# EAGLE design datalogger-v11 (EAGLE 7.7.0)
DATABASE: /Users/kina/Documents/eagle/PARTSDB.txt

## Sheet 1 of 2
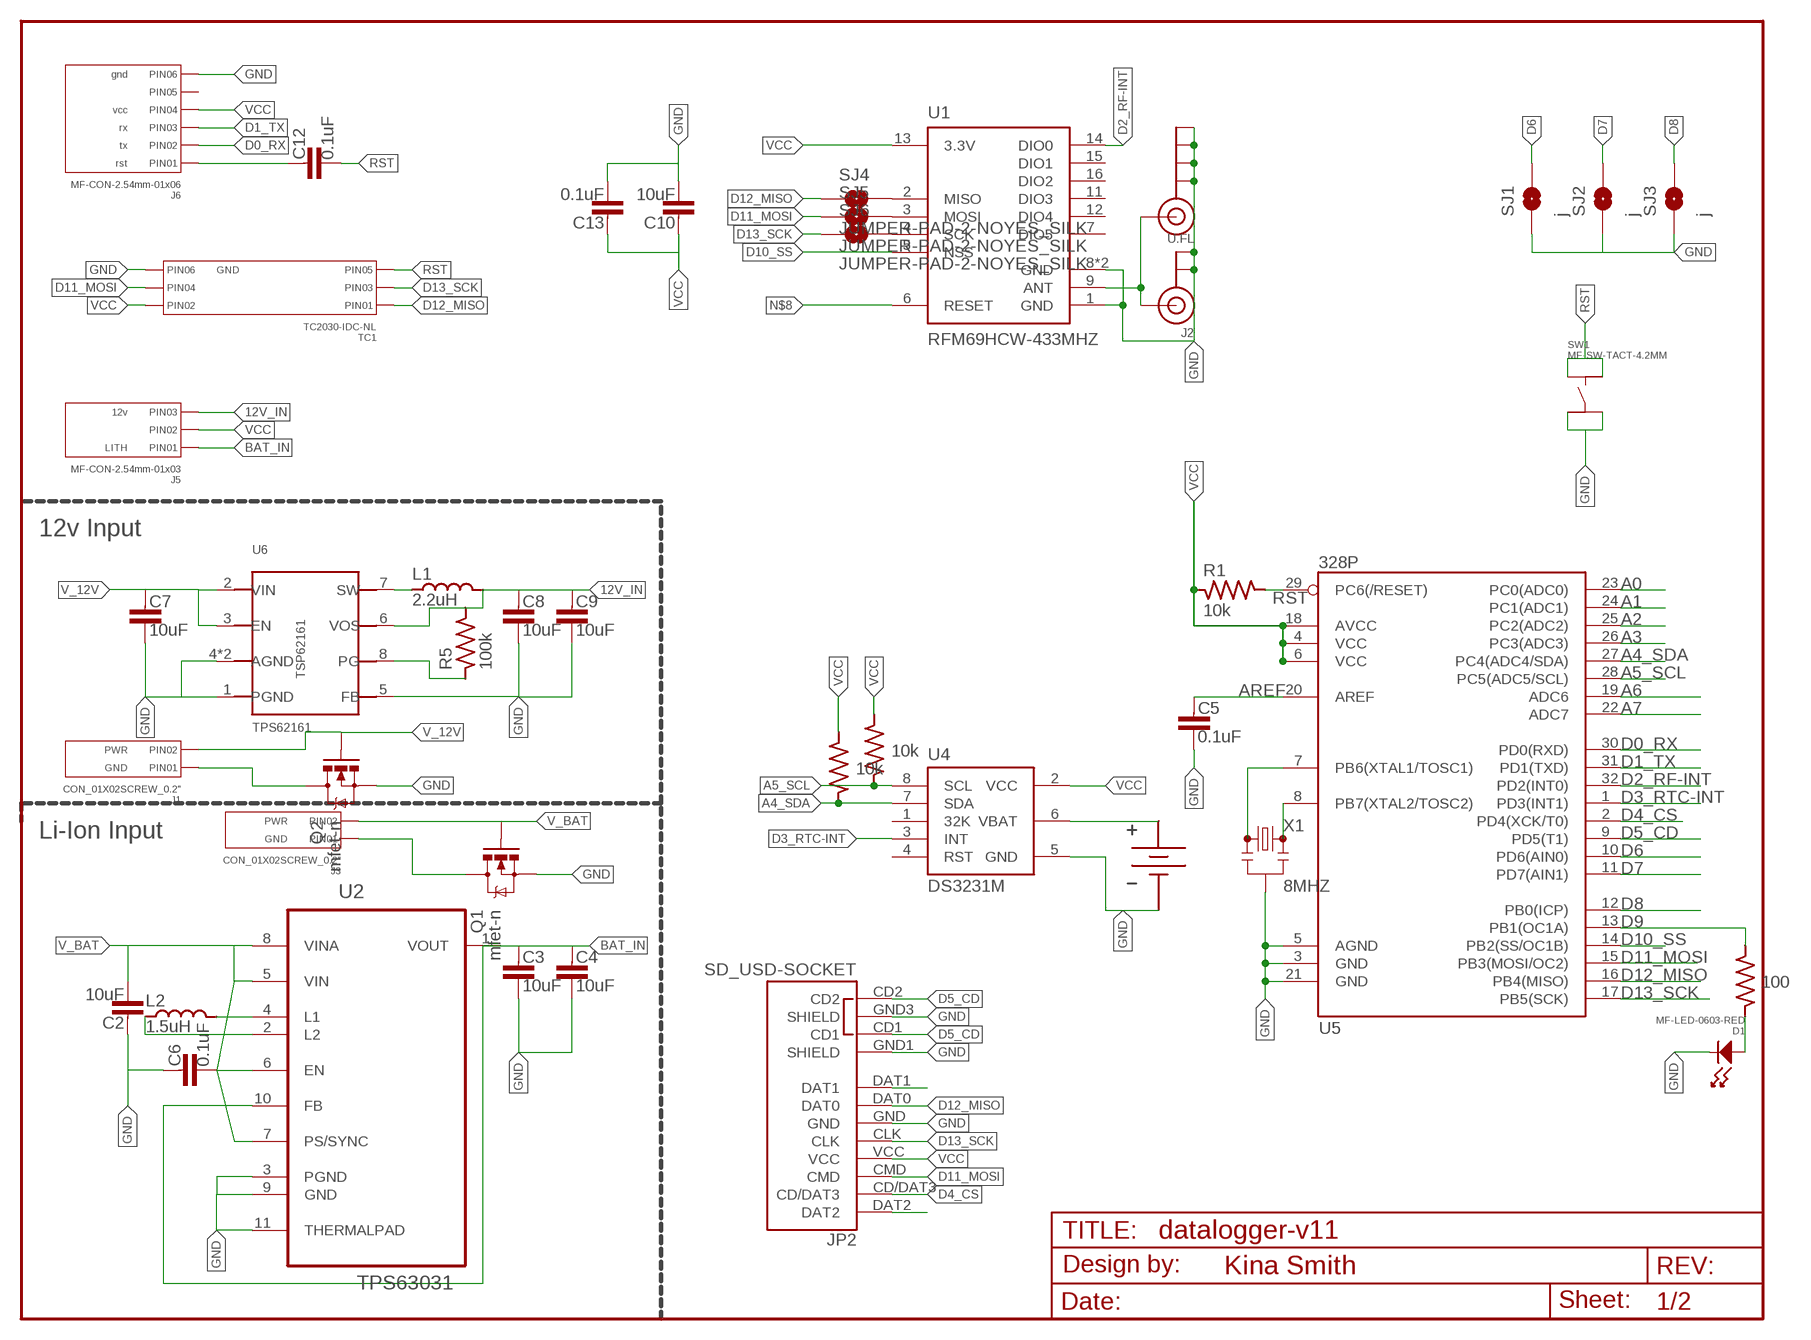
[diagram p0: schematic, sheet 1]

### Parts
BAT1  BATTERY_HOLDER12MM  [BAT_12MM]
C2  10uF  CAPACITOR_NP0805-N  [C0805-N]
C3  10uF  CAPACITOR_NP0805-N  [C0805-N]
C4  10uF  CAPACITOR_NP0805-N  [C0805-N]
C5  0.1uF  CAPACITOR_NP0603-N  [C0603-N]
C6  0.1uF  CAPACITOR_NP0603-N  [C0603-N]
C7  10uF  CAPACITOR_NP0805-N  [C0805-N]
C8  10uF  CAPACITOR_NP0805-N  [C0805-N]
C9  10uF  CAPACITOR_NP0805-N  [C0805-N]
C10  10uF  CAPACITOR_NP0805-N  [C0805-N]
C12  0.1uF  CAPACITOR_NP0603-N  [C0603-N]
C13  0.1uF  CAPACITOR_NP0603-N  [C0603-N]
D1  MF-LED-0603-RED  LED_SINGLE-0603-RED  [LED0603]
FRAME1  FRAME-LETTERNO_PACKAGE  [DUMMY]
J1  CON_01X02SCREW_0.2"  [SCREW_TERM_2POS]
J2  U.FL  ANTENNA_U.FL  [ADAFRUIT_U.FL]
J3  CON_01X02SCREW_0.2"  [SCREW_TERM_2POS]
J4  ANTENNA_SMA_EDGE  [SMA-EDGE]
J5  MF-CON-2.54mm-01x03  CON_01X03_PTH_2.54MM  [PTH_2.54MM_01X03]
J6  MF-CON-2.54mm-01x06  CON_01X06_PTH_2.54MM  [PTH_2.54MM_01X06]
JP2  SD_USD-SOCKET  [MICRO-SD-SOCKET-SDIO]
L1  2.2uH  INDUCTOR2520  [L2520]
L2  1.5uH  INDUCTOR3030  [L3030]
Q1  mfet-n  MOSFET-NCHANNELSOT23-3  [SOT23-3]
Q2  mfet-n  MOSFET-NCHANNELSOT23-3  [SOT23-3]
R1  10k  RESISTOR0603-N  [R0603-N]
R2  100  RESISTOR0603-N  [R0603-N]
R3  10k  RESISTOR0603-N  [R0603-N]
R4  10k  RESISTOR0603-N  [R0603-N]
R5  100k  RESISTOR0603-N  [R0603-N]
SJ1  j  JUMPER-PAD-2-NOYES_SILK  [PAD-JUMPER-2-NO_YES_SILK]
SJ2  j  JUMPER-PAD-2-NOYES_SILK  [PAD-JUMPER-2-NO_YES_SILK]
SJ3  j  JUMPER-PAD-2-NOYES_SILK  [PAD-JUMPER-2-NO_YES_SILK]
SJ4  JUMPER-PAD-2-NOYES_SILK  [PAD-JUMPER-2-NO_YES_SILK]
SJ5  JUMPER-PAD-2-NOYES_SILK  [PAD-JUMPER-2-NO_YES_SILK]
SJ6  JUMPER-PAD-2-NOYES_SILK  [PAD-JUMPER-2-NO_YES_SILK]
SW1  MF-SW-TACT-4.2MM  TACT_4.2MM  [TACT4.2MM]
TC1  TC2030-IDC-NL  CON_02X03_AVRISP_TC2030-IDC-NL  [TC2030-IDC-NL]
U1  RFM69HCW-433MHZ  [RFM69HCW-XXXS2]
U2  TPS63031  [SON50P260X260X80-11N]
U4  DS3231M  [SO08]
U5  328P  ATMEGA328P-AU  [TQFP32-08]
U6  TPS62161  [WSON-8]
X1  8MHZ  RESONATOR8MHZ  [RESONATOR-SMD]

### Nets
3V3L1: L2.P$2 U2.4(L1)
3V3L2: L2.P$1 U2.2(L2)
12V_IN: C8.1 C9.1 J5.P$3(PIN3) L1.P$2 R5.2 U6.6(VOS)
A0: U5.23(PC0(ADC0))
A1: U5.24(PC1(ADC1))
A2: U5.25(PC2(ADC2))
A3: U5.26(PC3(ADC3))
A4_SDA: R4.1 U4.7(SDA) U5.27(PC4(ADC4/SDA))
A5_SCL: R3.1 U4.8(SCL) U5.28(PC5(ADC5/SCL))
A6: U5.19(ADC6)
A7: U5.22(ADC7)
ANT: J2.3(SIGNAL) J4.SIG(SIGNAL) U1.9(ANT)
AREF: C5.1 U5.20(AREF)
BAT_IN: C3.1 C4.1 J5.P$1(PIN1) U2.1(VOUT) U2.10(FB)
D0_RX: J6.P$2(PIN2) U5.30(PD0(RXD))
D1_TX: J6.P$3(PIN3) U5.31(PD1(TXD))
D2_RF-INT: U1.14(DIO0) U5.32(PD2(INT0))
D3_RTC-INT: U4.3(INT) U5.1(PD3(INT1))
D4_CS: JP2.CD/DAT3 U5.2(PD4(XCK/T0))
D5_CD: JP2.CD1 JP2.CD2 U5.9(PD5(T1))
D6: SJ1.2 U5.10(PD6(AIN0))
D7: SJ2.2 U5.11(PD7(AIN1))
D8: SJ3.2 U5.12(PB0(ICP))
D9: R2.2 U5.13(PB1(OC1A))
D10_SS: U1.5(NSS) U5.14(PB2(SS/OC1B))
D11_MOSI: JP2.CMD SJ5.1 TC1.P$4(PIN4) U5.15(PB3(MOSI/OC2))
D12_MISO: JP2.DAT0 SJ4.1 TC1.P$1(PIN1) U5.16(PB4(MISO))
D13_SCK: JP2.CLK SJ6.1 TC1.P$3(PIN3) U5.17(PB5(SCK))
GND [power]: BAT1.GND C2.1 C3.2 C4.2 C5.2 C6.1 C7.2 C8.2 C9.2 C10.2 C13.2 D1.CATHODE J2.1(GND) J2.2(GND) J4.GND@0(GND) J4.GND@1(GND) J4.GND@2(GND) J4.GND@3(GND) J6.P$6(PIN6) JP2.GND JP2.GND1(SHIELD) JP2.GND3(SHIELD) Q1.2(S) Q2.2(S) SJ1.1 SJ2.1 SJ3.1 SW1.P$3 SW1.P$4 TC1.P$6(PIN6) U1.1(GND) U1.8(GND) U1.10(GND) U2.3(PGND) U2.9(GND) U2.11(THERMALPAD) U4.5(GND) U5.3(GND) U5.5(AGND) U5.21(GND) U6.1(PGND) U6.4(AGND) U6.5(FB) U6.P$9(AGND) X1.2
N$1: U5.7(PB6(XTAL1/TOSC1)) X1.1
N$2: D1.ANODE R2.1
N$3: JP2.DAT2
N$4: C12.1 J6.P$1(PIN1)
N$5: J3.GND(PIN1) Q1.3(D)
N$7: SJ4.2 U1.2(MISO)
N$8: U1.6(RESET)
N$9: SJ5.2 U1.3(MOSI)
N$10: BAT1.PWR@1(VBAT) BAT1.PWR@2(VBAT) U4.6(VBAT)
N$11: J1.GND(PIN1) Q2.3(D)
N$13: JP2.DAT1
N$15: SJ6.2 U1.4(SCK)
N$18: R5.1 U6.8(PG)
N$21: U5.8(PB7(XTAL2/TOSC2)) X1.3
RST: C12.2 R1.2 SW1.P$1 SW1.P$2 TC1.P$5(PIN5) U5.29(PC6(/RESET))
SW: L1.P$1 U6.7(SW)
V_12V: C7.1 J1.PWR(PIN2) Q2.1(G) U6.2(VIN) U6.3(EN)
V_BAT: C2.2 C6.2 J3.PWR(PIN2) Q1.1(G) U2.5(VIN) U2.6(EN) U2.7(PS/SYNC) U2.8(VINA)
VCC: C10.1 C13.1 J5.P$2(PIN2) J6.P$4(PIN4) JP2.VCC R1.1 R3.2 R4.2 TC1.P$2(PIN2) U1.13(3.3V) U4.2(VCC) U5.4(VCC) U5.6(VCC) U5.18(AVCC)
Unconnected: J6.P$5(PIN5) U1.7(DIO5) U1.11(DIO3) U1.12(DIO4) U1.15(DIO1) U1.16(DIO2) U4.1(32K) U4.4(RST)

### Notes on the sheet
- 12v Input
- Li-Ion Input

## Sheet 2 of 2
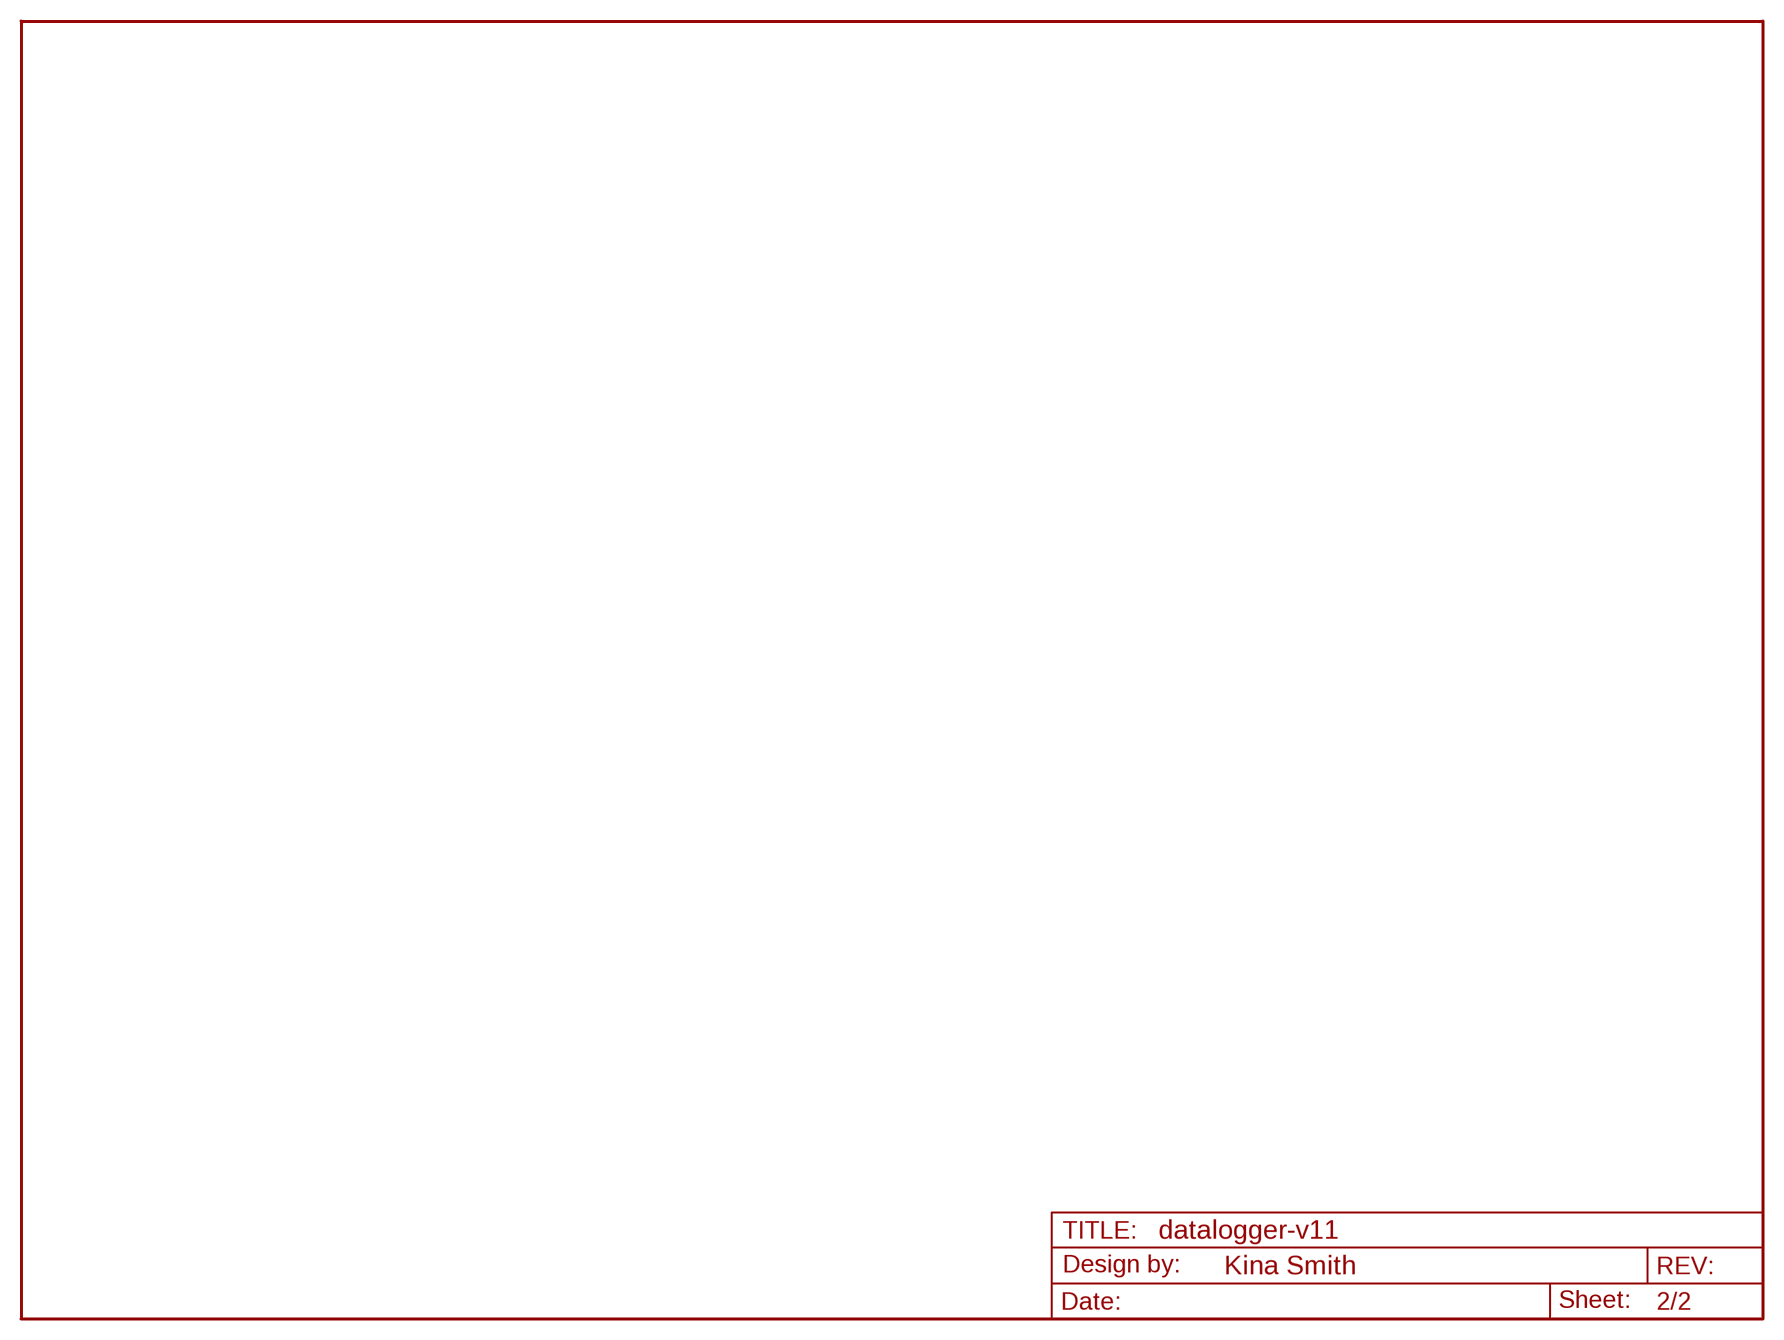
[diagram p1: schematic, sheet 2]

### Parts
FRAME3  FRAME-LETTERNO_PACKAGE  [DUMMY]

## Library data of the parts
BAT1 = My_Connectors:BATTERY_HOLDER; PARTNO: BK-885-TR
C2-C4 C7-C10 = My_Passives:CAPACITOR_NP; PARTNO: GRM21BR61C106KE15L
C5 C6 C12 C13 = My_Passives:CAPACITOR_NP; PARTNO: CC0603KRX7R7BB104
D1 = My_LEDs:LED_SINGLE: Library: MF_LEDs Description: Device for Single LED Packages. Manufacture part number (MFG#) can be added via Attributes.; HOUSEPART: YES; MPN: MF-LED-0603-RED; PARTNO: LTST-C191KRKT; POPULATE: 1; URL: https://factory.macrofab.com/part/MF-LED-0603-RED
FRAME1 FRAME3 = _my-parts:FRAME-LETTER: Schematic Frame Standard 8.5x11 US Letter frame; DESIGNER: Nobody; VERSION: v01
J1 J3 = My_Connectors:CON_01X02: Library: MF_Connectors Description: Header Connector with 02 Positions and 01 Rows. Use the LABEL Attribute to label the pin on the schematic and PCB. You can remove the attributes on the PCB by using the SMASH function on the part and then deleting the text.; LABEL01: GND; LABEL02: PWR; PARTNO: 1729128
J2 = My_Connectors:ANTENNA_U.FL: U.FL Antenna Connector; PARTNO: U.FL-R-SMT-1(10)
J4 = My_Connectors:ANTENNA_SMA_EDGE: SMA Antenna Connector End launch SMA connector. The paste layer has been removed so that the connector can be hand soldered onto the board after reflow.; PARTNO: EMPCB.SMAFSTJ.B.HT
J5 = My_Connectors:CON_01X03: Library: MF_Connectors Description: Header Connector with 03 Positions and 01 Rows. Use the LABEL Attribute to label the pin on the schematic and PCB. You can remove the attributes on the PCB by using the SMASH function on the part and then deleting the text.; HOUSEPART: YES; LABEL01: LITH; LABEL03: 12v; MPN: MF-CON-2.54mm-01x03; PARTNO: NA; POPULATE: 1; URL: https://factory.macrofab.com/part/MF-CON-2.54mm-01x03
J6 = My_Connectors:CON_01X06: Library: MF_Connectors Description: Header Connector with 6 Positions and 01 Rows. Use the LABEL Attribute to label the pin on the schematic and PCB. You can remove the attributes on the PCB by using the SMASH function on the part and then deleting the text.; HOUSEPART: YES; LABEL01: rst; LABEL02: tx; LABEL03: rx; LABEL04: vcc; LABEL06: gnd; MPN: MF-CON-2.54mm-01x06; PARTNO: NA; POPULATE: 1; URL: https://factory.macrofab.com/part/MF-CON-2.54mm-01x06
JP2 = My_Connectors:SD_USD-SOCKET: microSD Socket Push-push type uSD socket with full SDIO signal mapping. Spark Fun Electronics SKU : PRT-00127. tDoc lines correctly indicate media card edge positions when inserting (unlocked, locked, depressed). NOTE: CD1 and CD2 are connected internally, and short to ground when card is removed.; PARTNO: 101-00660-68-6; PROD_ID: CONN-07820
L1 = My_Passives:INDUCTOR; PARTNO: VLS252012T-2R2M1R3
L2 = My_Passives:INDUCTOR; PARTNO: NR3015T1R5N
Q1 Q2 = My_Descrete_Semiconductors:MOSFET-NCHANNEL: Common NMOSFET Parts MFG P/N Store ID Prod ID FDD8780 TRANS-09984 SI7820DN TRANS-11055 FDS6630A IC-08089 2N7002PW TRANS-11151 FQP30N06L COM-10213 TRANS-10060 BSS123LT1G TRANS-08345 BSS138 TRANS-00830 BS170 2N7000; PARTNO: SI2312BDS-T1-GE3
R1 R3 R4 = My_Passives:RESISTOR; PARTNO: RC0603FR-0710KL
R2 = My_Passives:RESISTOR; PARTNO: RC0603FR-07100RL
R5 = My_Passives:RESISTOR; PARTNO: RC0603FR-07100KL
SJ1-SJ6 = My_Passives:JUMPER-PAD-2-NO; PARTNO: NA
SW1 = My_ElectroMechanical:TACT: Library: MF_Switches Description: Device for Tact Switches. Manufacture part number (MFG#) can be added via Attributes.; HOUSEPART: YES; MPN: MF-SW-TACT-4.2MM; PARTNO: PTS810 SJM 250 SMTR LFS; POPULATE: 1; URL: https://factory.macrofab.com/part/MF-SW-TACT-4.2MM
TC1 = My_Connectors:CON_02X03: Library: MF_Connectors Description: Header Connector with 6 Positions and 02 Rows. Use the LABEL Attribute to label the pin on the schematic and PCB. You can remove the attributes on the PCB by using the SMASH function on the part and then deleting the text.; HOUSEPART: NO; LABEL06: GND; MPN: TC2030-IDC-NL; PARTNO: NA; POPULATE: 0; URL: http://www.tag-connect.com/AVRISP
U1 = My_RF:RFM69H; PARTNO: COM-13910; PROD_ID: IC-11997, IC-12053
U2 = My_IC_Power:TPS63031: HIGH EFFICIENCY SINGLE INDUCTOR BUCK-BOOST CONVERTER WITH 1-A SWITCHES; MPN: TPS63031DSK; OC_FARNELL: 1686303; OC_NEWARK: 19P7478; PACKAGE: SON-10; PARTNO: TPS63031DSKR; SUPPLIER: Texas Instruments
U4 = My_IC_Digital:DS3231M: The DS3231M is a low-cost extremely accurate I2C realtime clock (RTC). Datasheet <https://datasheets.maximintegrated.com/en/ds/DS3231M.pdf>; PARTNO: DS3231MZ/V+
U5 = My_IC_Digital:ATMEGA328P: Atmel 32-pin 8-bit micro 16k flash.; PARTNO: ATMEGA328P-AU
U6 = My_IC_Power:TPS62161; PARTNO: TPS62161DSGR
X1 = My_xTal:RESONATOR: Resonator Small SMD resonator. Used, eg, on the Arduino Pro/ Pro Mini boards. 8MHz- XTAL-08895 16MHz- XTAL-08900; PARTNO: CSTCE8M00G55-R0; PROD_ID: XTAL-08895

## Net classes
1 power: width 0.381 mm, clearance 0.254 mm

## Board
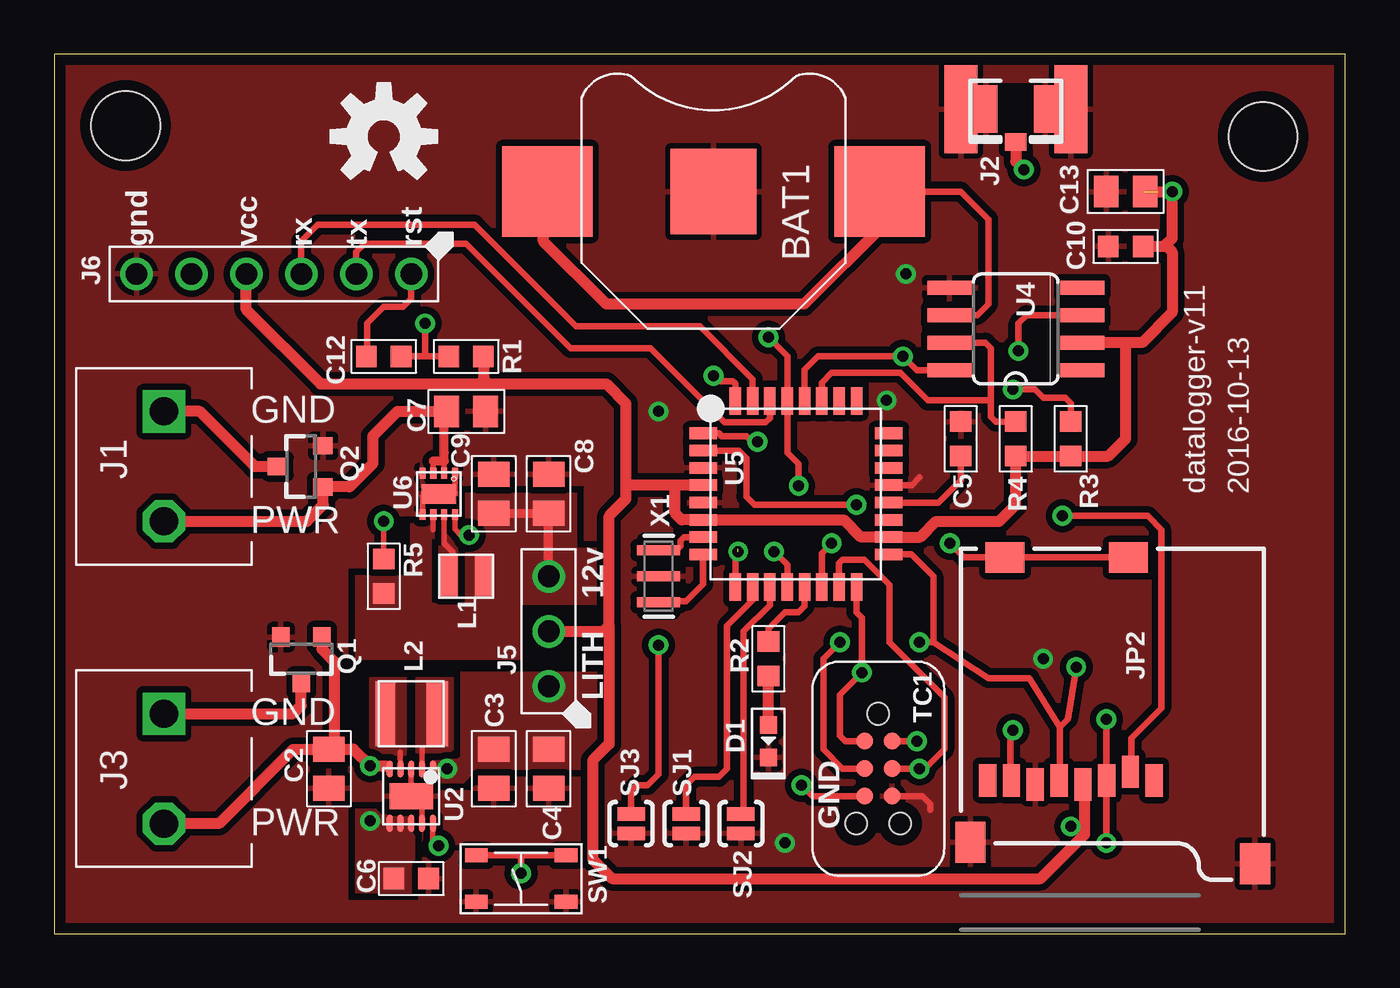
[diagram p2: board, top side]
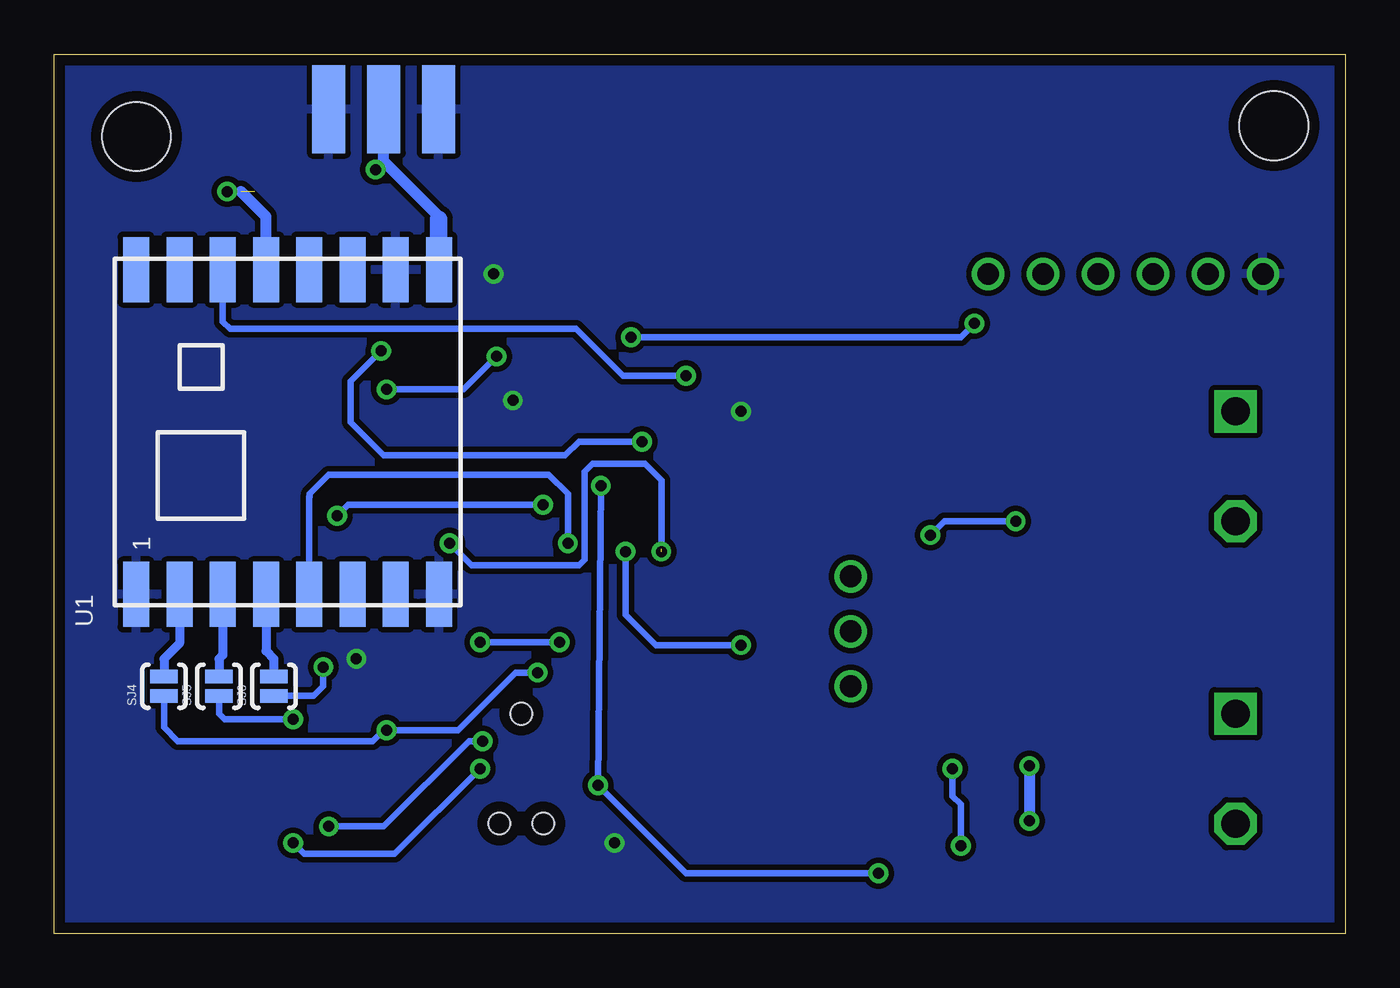
[diagram p3: board, bottom side, seen from below]

Size 59.69 x 40.64 mm. Coordinates in mm from the lower left corner, seen from the top.
Outline: 0,0 59.69,0 59.69,40.64 0,40.64 0,0
Copper layers (1*16): Top 0.0178mm / dielectric 59mil / Bottom 0.0178mm
Design rules "SSC-EAGLE-2Lyr_v1.0.0.3": minimum track width 6mil, minimum drill 14mil, track to track 6mil, track to pad 6mil, pad to pad 6mil, via to via 6mil, smd to smd 6mil, copper to edge 20mil, drill to drill 16mil, minimum pad ring 8mil, minimum via ring 8mil, stop-mask expansion 3mil, vias tented up to drill 0mil, thermal gap 10mil
Holes 3.17 mm at 3.3,37.34 55.88,36.83

### Footprints (pad centres in the part's own frame; a part is rotated, then mirrored left to right if it is on the bottom)
BAT_12MM = smd 3.962 x 3.962: GND 0,0 | smd 4.17 x 4.17: PWR@1 -7.685,0; PWR@2 7.685,0
C0805-N = smd 1.15 x 1.45: 1 -0.9,0; 2 0.9,0
C0603-N = smd 0.95 x 1: 1 -0.8,0; 2 0.8,0
LED0603 = smd 0.8 x 0.8: ANODE 0.75,0; CATHODE -0.75,0
SCREW_TERM_2POS = drill 1.3 square: GND -2.54,0 | drill 1.3 octagon: PWR 2.54,0
ADAFRUIT_U.FL = smd 2.2 x 1.05: 1 0,1.375; 2 0,-1.375 | smd 0.8 x 1: 3 1.525,0
SMA-EDGE = smd 1.524 x 4.064: GND@0 0,0; GND@1 5.08,0; SIG 2.54,0 | smd 1.524 x 4.064 bottom: GND@2 0,0; GND@3 5.08,0
PTH_2.54MM_01X03 = drill 1: P$1 -2.54,0; P$2 0,0; P$3 2.54,0
PTH_2.54MM_01X06 = drill 1: P$1 -6.35,0; P$2 -3.81,0; P$3 -1.27,0; P$4 1.27,0; P$5 3.81,0; P$6 6.35,0
MICRO-SD-SOCKET-SDIO = smd 1.8 x 1.4: CD1 11.92,0.4; CD2 6.22,0.4 | smd 0.8 x 1.5: CD/DAT3 6.13,10.3; CLK 9.43,10.7; CMD 7.23,10.7; DAT0 11.63,10.7; DAT1 12.73,10.7; DAT2 5.03,10.7; GND 10.53,10.9; VCC 8.33,10.9 | smd 1.4 x 1.9: GND1 0.37,14.55; GND3 13.52,13.55
L2520 = smd 0.85 x 2: P$1 -0.825,0; P$2 0.825,0
L3030 = smd 1 x 3: P$1 -1.2,0 | smd 0.9 x 3: P$2 1.2,0
SOT23-3 = smd 0.8 x 0.9: 1 -0.95,-1; 2 0.95,-1; 3 0,1.1
R0603-N = smd 0.95 x 1: 1 -0.8,0; 2 0.8,0
PAD-JUMPER-2-NO_YES_SILK = smd 0.635 x 1.27: 1 -0.45,0; 2 0.45,0
TACT4.2MM = smd 1.05 x 0.65: P$1 -2.075,1.075; P$2 2.075,1.075; P$3 -2.075,-1.075; P$4 2.075,-1.075
TC2030-IDC-NL = smd 0.787 x 0.787: P$1 -1.27,-0.635; P$2 -1.27,0.635; P$3 0,-0.635; P$4 0,0.635; P$5 1.27,-0.635; P$6 1.27,0.635 | hole 0.991: 2.54,1.016; 2.54,-1.016; -2.54,0
RFM69HCW-XXXS2 = smd 3 x 1.2: 1 -7.5,7; 2 -7.5,5; 3 -7.5,3; 4 -7.5,1; 5 -7.5,-1; 6 -7.5,-3; 7 -7.5,-5; 8 -7.5,-7; 9 7.5,-7; 10 7.5,-5; 11 7.5,-3; 12 7.5,-1; 13 7.5,1; 14 7.5,3; 15 7.5,5; 16 7.5,7
SON50P260X260X80-11N = smd 0.8 x 0.289: 1 -1.25,1; 2 -1.25,0.5; 3 -1.25,0; 4 -1.25,-0.5; 5 -1.25,-1; 6 1.25,-1; 7 1.25,-0.5; 8 1.25,0; 9 1.25,0.5; 10 1.25,1 | smd 1.2 x 2: 11 0,0
SO08 = smd 0.66 x 2.032: 1 -1.905,-3.073; 2 -0.635,-3.073; 3 0.635,-3.073; 4 1.905,-3.073; 5 1.905,3.073; 6 0.635,3.073; 7 -0.635,3.073; 8 -1.905,3.073
TQFP32-08 = smd 1.27 x 0.533: 1 -4.293,2.8; 2 -4.293,2; 3 -4.293,1.2; 4 -4.293,0.4; 5 -4.293,-0.4; 6 -4.293,-1.2; 7 -4.293,-2; 8 -4.293,-2.8; 17 4.293,-2.8; 18 4.293,-2; 19 4.293,-1.2; 20 4.293,-0.4; 21 4.293,0.4; 22 4.293,1.2; 23 4.293,2; 24 4.293,2.8 | smd 0.533 x 1.27: 9 -2.8,-4.293; 10 -2,-4.293; 11 -1.2,-4.293; 12 -0.4,-4.293; 13 0.4,-4.293; 14 1.2,-4.293; 15 2,-4.293; 16 2.8,-4.293; 25 2.8,4.293; 26 2,4.293; 27 1.2,4.293; 28 0.4,4.293; 29 -0.4,4.293; 30 -1.2,4.293; 31 -2,4.293; 32 -2.8,4.293
WSON-8 = smd 0.28 x 0.5: 1 -0.75,-0.95; 2 -0.25,-0.95; 3 0.25,-0.95; 4 0.75,-0.95; 5 0.75,0.95; 6 0.25,0.95; 7 -0.25,0.95; 8 -0.75,0.95 | smd 1.6 x 0.9: P$9 0,0
RESONATOR-SMD = smd 0.45 x 2: 1 -1.2,0; 2 0,0; 3 1.2,0

### Placement (x,y rotation side)
BAT1  30.48,34.29 0 top
C2  12.7,7.62 90 top
C3  20.32,7.62 270 top
C4  22.86,7.62 270 top
C5  41.91,22.86 90 top
C6  16.51,2.54 180 top
C7  19.05,24.13 0 top
C8  22.86,20.32 90 top
C9  20.32,20.32 90 top
C10  49.53,34.29 180 top
C12  15.24,26.67 0 top
C13  49.53,31.75 180 top
D1  33.02,8.89 90 top
FRAME1  0,-1.27 0 top
FRAME3  1.27,-1.27 0 top
J1  5.08,21.59 270 top
J2  44.45,38.1 270 top
J3  5.08,7.62 270 top
J4  46.99,38.1 0 bottom
J5  22.86,13.97 90 top
J6  10.16,30.48 180 top
JP2  55.88,17.78 180 top
L1  19.05,16.51 0 top
L2  16.51,10.16 180 top
Q1  11.43,12.7 180 top
Q2  11.43,21.59 90 top
R1  19.05,26.67 180 top
R2  33.02,12.7 90 top
R3  46.99,22.86 270 top
R4  44.45,22.86 270 top
R5  15.24,16.51 270 top
SJ1  29.21,5.08 90 top
SJ2  31.75,5.08 90 top
SJ3  26.67,5.08 90 top
SJ4  54.61,11.43 90 bottom
SJ5  52.07,11.43 90 bottom
SJ6  49.53,11.43 90 bottom
SW1  21.59,2.54 0 top
TC1  38.1,7.62 270 top
U1  48.9,23.18 90 bottom
U2  16.51,6.35 270 top
U4  44.45,27.94 90 top
U5  34.29,20.32 0 top
U6  17.78,20.32 180 top
U$1  [OSHW-LOGO-M]  15.24,36.83 0 top
X1  27.94,16.51 270 top

### Tracks (layer width: path | path; a pad name or v marks a point on that pad's centre or on a via)
3V3L1
  Top 0.254: U2.4 16,8.38
  pour Top (isolate 0.305, no thermals): 16.26,8.26 16.26,11.81 14.61,11.81 14.61,8.64 14.99,8.26
3V3L2
  Top 0.254: U2.2 17.02,8.51
  pour Top (isolate 0.305, no thermals): 16.76,8.38 16.76,11.81 18.41,11.81 18.41,8.51 18.29,8.38
12V_IN
  Top 0.254: U6.6 17.53,18.67
  Top 0.406: C9.1 C8.1 22.86,16.89 23.24,16.51
  pour Top (isolate 0.305, no thermals): 17.78,18.92 16.51,18.92 16.51,16.51 13.97,16.51 13.97,12.7 21.59,12.7 21.59,15.24 25.15,15.24 25.15,17.78 24.13,17.78 24.13,20.32 19.05,20.32 19.05,15.24 17.4,15.24 17.4,17.78 17.4,18.29 17.78,18.29 17.78,18.8
A4_SDA
  Top 0.305: 43.31,24.64 43.31,27.05 43.05,27.3 U4.7 | 43.31,24.64 43.31,23.88 43.52,23.66 R4.1 | U5.27 35.49,25.46 35.94,25.91 39.12,25.91 40.39,24.64 43.31,24.64
A5_SCL  (via drill 0.51)
  Top 0.305: U5.28 34.69,26.05 35.31,26.67 v39.24,26.67 39.88,26.04 U4.8 | R3.1 46.99,24.51 46.74,24.77 45.72,24.77 45.34,25.15 v44.32,25.15
  Bottom 0.305: v39.24,26.67 40.77,25.15 v44.32,25.15
ANT  (via drill 0.51)
  Top 0.508: J2.3 44.45,35.69 v44.83,35.31
  Bottom 0.508: 41.91,33.02 41.91,33.15 44.45,35.69 | 44.45,35.69 J4.SIG | v44.83,35.31 44.45,35.69
  Bottom 0.813: 41.91,33.02 41.91,30.69 U1.9
AREF
  Top 0.305: U5.20 40.88,19.92 41.91,20.95 C5.1
BAT_IN  (via drill 0.51)
  Top 0.254: C3.1 | U2.10 17.5,4.34 v17.78,4.06 | v18.16,7.62 17.55,7.62 U2.1
  Bottom 0.305: v17.78,4.06 17.78,5.97 18.16,6.35 v18.16,7.62
  pour Top (isolate 0.305, rank 2, no thermals): 17.4,6.99 17.4,8.38 18.29,8.38 18.54,8.51 18.54,12.06 25.15,12.06 25.15,9.02 24.38,8.26 24.38,7.62 19.56,7.62 18.92,6.99
D0_RX
  Top 0.305: J6.P$2 13.97,31.5 14.35,31.88 19.05,31.88 23.88,27.05 27.56,27.05 30.99,23.62 32.89,23.62 33.09,23.82 U5.30
D1_TX
  Top 0.305: J6.P$3 11.43,32 12.19,32.77 19.43,32.77 24.13,28.07 29.84,28.07 32.29,25.62 U5.31
D2_RF-INT  (via drill 0.51)
  Top 0.305: U5.32 31.49,25.41 31.37,25.53 30.73,25.53 v30.48,25.78
  Bottom 0.305: U1.14 51.9,28.27 51.56,27.94 35.56,27.94 33.4,25.78 v30.48,25.78
D3_RTC-INT  (via drill 0.51)
  Top 0.305: v44.58,26.92 44.58,28.19 44.96,28.57 U4.3 | v32.51,22.73 32.26,22.73 32,22.99 30.86,22.99 30.73,23.11 U5.1
  Bottom 0.305: v44.58,26.92 45.97,25.53 45.97,23.62 44.45,22.1 36.07,22.1 35.43,22.73 v32.51,22.73
D4_CS  (via drill 0.51)
  Top 0.305: v46.61,19.3 50.55,19.3 51.18,18.67 51.18,10.41 49.78,9.02 49.78,7.51 JP2.CD/DAT3 | U5.2 31.66,22.32 32,21.97 32,20.19 32.38,19.81 v37.08,19.81
  Bottom 0.305: v37.08,19.81 46.1,19.81 v46.61,19.3
D5_CD  (via drill 0.51)  (1 unrouted)
  Top 0.305: JP2.CD2 JP2.CD1 42.06,17.38 v41.4,18.03 | U5.9 31.49,17.52 v31.62,17.65
  Bottom 0.305: 31.62,17.78 31.62,20.95 32.38,21.72 34.8,21.72 35.18,21.34 35.18,17.27 35.43,17.02 40.39,17.02 v41.4,18.03
D6
  Top 0.305: SJ1.2 29.21,6.86 29.59,7.24 30.73,7.24 31.11,7.62 31.11,14.22 32.29,15.4 U5.10
D7
  Top 0.305: SJ2.2 31.88,5.66 31.88,13.97 33.09,15.18 U5.11
D8  (via drill 0.51)
  Top 0.305: v27.94,13.34 27.94,7.37 27.43,6.86 26.92,6.86 26.67,6.6 SJ3.2 | U5.12 33.89,17.04 v33.27,17.65
  Bottom 0.305: v33.27,17.65 33.27,14.73 31.88,13.34 v27.94,13.34
D9
  Top 0.305: 33.02,13.34 R2.2 33.02,14.1 33.78,14.86 34.42,14.86 34.69,15.13 U5.13
D10_SS  (via drill 0.51)
  Top 0.305: U5.14 35.49,17.58 v35.94,18.03
  Bottom 0.305: U1.5 47.9,20.18 47.88,20.19 47.88,20.32 46.99,21.21 36.83,21.21 35.94,20.32 v35.94,18.03
D11_MOSI  (via drill 0.51)
  Top 0.305: v48.64,9.91 48.64,7.62 v48.64,4.19 | U5.15 36.29,17.11 36.45,17.27 37.47,17.27 38.61,16.13 38.61,13.46 41.15,10.92 41.15,8.51 40.26,7.62 v40.01,7.62 TC1.P$4 38.86,7.62
  Top 0.508: JP2.CMD 48.65,7.61 48.64,7.62
  Bottom 0.305: v40.01,7.62 43.94,3.68 48.13,3.68 v48.64,4.19 | v48.64,9.91 51.82,9.91 52.07,10.16 SJ5.1
D12_MISO  (via drill 0.51)
  Top 0.305: 44.2,7.03 44.2,9.14 v44.32,9.4 | TC1.P$1 36.58,8.89 36.32,9.14 36.32,11.05 v37.34,12.06 37.34,14.61 37.08,14.86 U5.16
  Top 0.508: 44.2,7.03 JP2.DAT0
  Bottom 0.305: SJ4.1 54.61,9.53 53.98,8.89 44.96,8.89 44.45,9.4 v44.32,9.4 41.02,9.4 38.35,12.06 v37.34,12.06
D13_SCK  (via drill 0.51)
  Top 0.305: 46.48,7.11 46.48,7.62 46.48,9.53 | 46.48,9.53 45.09,11.81 43.18,11.81 40.64,13.46 | v47.24,12.32 46.86,9.91 46.48,9.53 | 40.64,13.46 40.64,16.51 39.63,17.52 U5.17 | v40.01,13.46 40.64,13.46 | TC1.P$3 36.45,7.62 35.56,8.51 35.56,12.7 v36.32,13.46
  Top 0.508: JP2.CLK 46.45,7.59 46.48,7.62
  Bottom 0.305: v36.32,13.46 v40.01,13.46 | SJ6.1 47.69,10.98 47.24,11.43 v47.24,12.32
GND  (via drill 0.51)
  Top 0.254: U2.9 17.02,5.97 16.89,5.97 U2.11 U2.3 | U6.5 17.03,20.18 | 17.03,20.18 17.02,20.19 | 17.03,20.18 17.64,20.18 U6.P$9 18.54,20.32 18.53,20.33 U6.1
  Top 0.305: U5.21 39.64,20.72 40.01,21.08 | TC1.P$6 40.13,6.35 40.51,5.97 40.51,5.71
  other vias: 33.78,4.19 45.72,12.7 39.37,30.48 38.48,24.64 27.94,24.13
  pour Bottom: 0,0 59.69,0 59.69,40.64 0,40.64
  pour Top (isolate 0.305, rank 6): 0,0 59.69,0 59.69,40.64 0,40.64
N$1
  Top 0.305: 27.66,17.68 X1.1 28.01,17.78 28.83,17.78 28.96,17.91 28.96,18.16 29.11,18.32 U5.7
N$2
  Top 0.508: D1.ANODE R2.1
N$4
  Top 0.305: J6.P$1 16.51,29.34 16.13,28.96 15.24,28.96 14.48,28.19 14.48,26.71 C12.1
N$5
  Top 0.508: J3.GND 11.05,10.16 11.43,10.54 Q1.3
N$7
  Bottom 0.406: U1.2 53.9,13.41 54.61,12.7 SJ4.2
N$9
  Bottom 0.406: U1.3 51.9,12.88 52.07,12.7 SJ5.2
N$10
  Top 0.305: BAT1.PWR@2 41.91,34.29 43.18,33.02 43.18,29.08 42.67,28.57 U4.6
  Top 0.508: BAT1.PWR@2 38.35,32.77 34.67,29.08 25.53,29.08 22.61,32 BAT1.PWR@1
N$11
  Top 0.508: J1.GND 6.73,24.13 9.27,21.59 Q2.3
N$15
  Bottom 0.406: U1.4 49.9,13.06 49.53,12.7 SJ6.2
N$18  (via drill 0.51)
  Top 0.254: v15.24,19.05 R5.1 | v19.18,18.41 18.8,18.41 18.53,18.68 U6.8
  Bottom 0.305: v15.24,19.05 18.54,19.05 v19.18,18.41
N$21
  Top 0.254: 28.2,15.25 X1.3
  Top 0.305: 28.21,15.24 28.2,15.25 | U5.8 30,16.15 29.21,15.37 28,15.37 X1.3
RST  (via drill 0.51)
  Top 0.305: v33.02,27.56 33.89,26.69 U5.29 33.91,24.59 33.91,22.23 34.42,21.72 v34.42,20.7 | TC1.P$5 35.05,6.35 v34.54,6.86 | SW1.P$1 SW1.P$2 21.65,3.62 21.59,3.56 v21.59,2.79 | 17.14,26.67 C12.2 | R1.2 17.14,26.67 | 17.14,26.67 v17.14,28.19
  Bottom 0.305: v33.02,27.56 17.78,27.56 v17.14,28.19 | v34.42,20.7 v34.54,6.86 30.48,2.79 v21.59,2.79
SW
  Top 0.254: L1.P$1 18.41,16.7 18.41,17.65 18.03,18.03 U6.7
  pour Top (isolate 0.305, rank 2, no thermals): 17.78,19.05 17.78,17.78 17.4,17.78 17.4,15.24 19.05,15.24 19.05,17.78 18.29,18.54 18.29,19.05
V_12V
  Top 0.254: 17.53,21.84 U6.3 | U6.2 18.03,22.23
  Top 0.406: C7.1 18.03,24.01 18.03,22.23 18.03,21.84 17.53,21.84
  Top 0.508: C7.1 15.88,24.13 14.73,22.99 14.73,21.72 13.65,20.64 Q2.1 12.45,20.62 12.45,19.81 11.68,19.05 J1.PWR
V_BAT  (via drill 0.51)
  Top 0.254: U2.5 15.42,7.57 15.24,7.75
  Top 0.508: C2.2 11.05,8.51 7.62,5.08 J3.PWR | C2.2 13.83,8.52 v14.61,7.75 15.24,7.75 15.34,7.75 | Q1.1 12.38,13.15 12.95,12.57 12.95,8.77 C2.2
  Bottom 0.508: v14.61,7.75 v14.61,5.21
  pour Top (isolate 0.305, rank 2, no thermals): 16.64,5.46 15.11,5.46 14.86,5.71 13.97,5.71 13.97,1.91 16.51,1.91 16.51,3.3 16.64,3.43
VCC  (via drill 0.51)  (1 unrouted)
  Top 0.305: TC1.P$2 v39.88,8.89
  Top 0.508: 25.65,14.22 25.65,19.3 26.43,20.09 26.43,20.83 | 25.65,14.22 25.4,13.97 J5.P$2 | 25.65,14.22 25.65,8.76 24.89,8 24.89,3.43 25.78,2.54 45.59,2.54 47.62,4.57 47.62,5.08 | 26.43,20.83 26.43,24.49 25.53,25.4 20.07,25.4 | U5.4 28.7,20.72 | 28.7,20.72 26.54,20.72 26.43,20.83 | 49.4,27.3 50.29,27.3 51.69,28.7 51.69,31.5 51.44,31.75 C13.1 51.31,31.75 51.69,32.13 v51.69,34.29 C10.1 | 49.4,27.3 U4.2 | JP2.VCC 47.62,6.8 47.62,5.08 | J6.P$4 8.89,28.83 12.32,25.4 20.07,25.4 | 49.4,27.3 49.53,27.18 49.53,22.86 48.73,22.06 R3.2 R4.2 44.45,19.81 43.69,19.05 40.77,19.05 40.04,18.32 U5.18 37.31,18.32 36.51,19.12 U5.6 29.01,19.12 28.7,19.43 28.7,20.72 | R1.1 19.85,25.62 20.07,25.4 | v46.99,4.95 47.5,4.95 47.62,5.08
  Bottom 0.305: v39.88,8.89 40.51,8.89 44.45,4.95 v46.99,4.95
  Bottom 0.508: U1.13 49.9,33.13 51.05,34.29

### Text on the board
tNames: datalogger-v11 | 2016-10-13